# EAGLE design PCB_Draft_2 (EAGLE 9.6.2)
AUTHOR: R. Hall, A. Singh, K.Quizon; BOARD_NAME: ESP32 I2C Exp / M Driver; DOC_NUM: 0; PROJECT_NAME: R8-O7 PCB; REVISION: 4
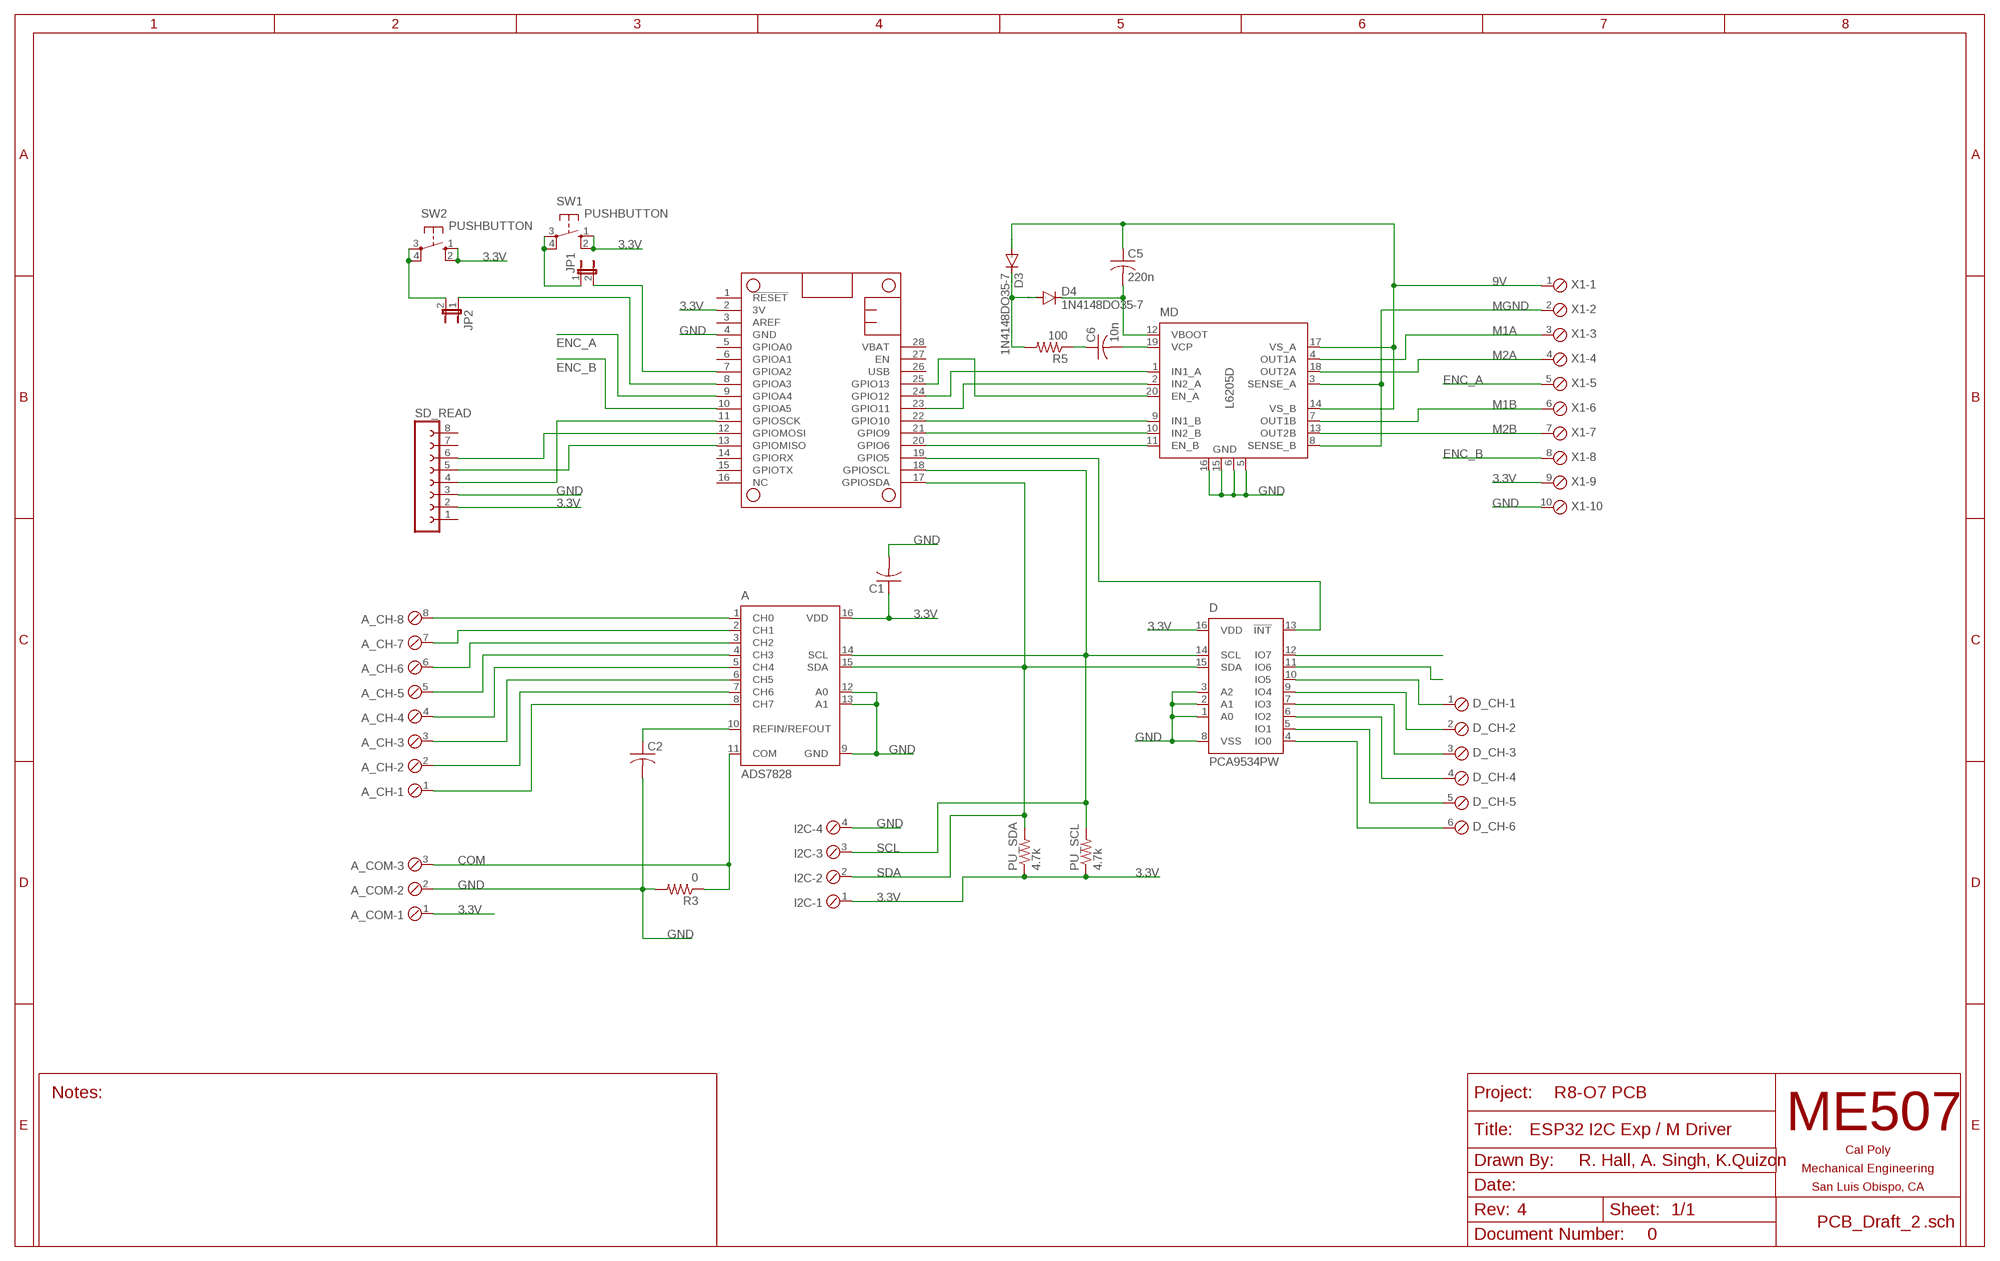
[diagram p0: schematic, sheet 1]

## Parts
A  ADS7828  [TSSOP16-PW]
A_CH  SCREWTERM_8P_254  [8POL254]
A_COM  SCREWTERM_3P_254  [3POL254]
C1  C-USC0805  [C0805]
C2  C-USC0805  [C0805]
C5  220n  C-USC0805  [C0805]
C6  10n  C-USC0805  [C0805]
D  PCA9534PW  [TSSOP16]
D3  1N4148DO35-7  [DO35-7]
D4  1N4148DO35-7  [DO35-7]
D_CH  SCREWTERM_6P_254  [6POL254]
FTHRWNG  FEATHERWINGEXTENDED_BOTH_ENDS  [FEATHERWING]
I2C  SCREWTERM_4P_254  [4POL254]
JP1  JP1E  [JP1]
JP2  JP1E  [JP1]
MD  L6205D  [SO20]
PU_SCL  4.7k  R-US_M0805  [M0805]
PU_SDA  4.7k  R-US_M0805  [M0805]
R3  0  R-US_M0805  [M0805]
R5  100  R-US_M0805  [M0805]
SD_READ  FE08-1  [FE08]
SW1  PUSHBUTTON  [B3F-10XX]
SW2  PUSHBUTTON  [B3F-10XX]
X1  SCREWTERM_10P_254  [10POL254]

## Nets
3.3V: A.16(VDD) A_COM.1 C1.1 D.16(VDD) FTHRWNG.2(3V) I2C.1 PU_SCL.1 PU_SDA.1 SD_READ.2 SW1.1(S) SW1.2(S1) SW2.1(S) SW2.2(S1) X1.9
9V: C5.1 D3.A MD.14(VS_B) MD.17(VS_A) X1.1
COM: A.11(COM) A_COM.3 R3.1
ENC_A: FTHRWNG.9(GPIOA4) X1.5
ENC_B: FTHRWNG.10(GPIOA5) X1.8
GND: A.9(GND) A.12(A0) A.13(A1) A_COM.2 C1.2 C2.2 D.1(A0) D.2(A1) D.3(A2) D.8(VSS) FTHRWNG.4(GND) I2C.4 MD.5(GND) MD.6(GND) MD.15(GND) MD.16(GND) R3.2 SD_READ.3 X1.10
M1A: MD.4(OUT1A) X1.3
M1B: MD.7(OUT1B) X1.6
M2A: MD.18(OUT2A) X1.4
M2B: MD.13(OUT2B) X1.7
MGND: MD.3(SENSE_A) MD.8(SENSE_B) X1.2
N$1: D.12(IO7)
N$2: D.11(IO6)
N$3: D.10(IO5) D_CH.1
N$4: D.9(IO4) D_CH.2
N$5: D.7(IO3) D_CH.3
N$6: D.6(IO2) D_CH.4
N$7: D.5(IO1) D_CH.5
N$8: D.4(IO0) D_CH.6
N$9: A.1(CH0) A_CH.8
N$10: A.2(CH1) A_CH.7
N$11: A.3(CH2) A_CH.6
N$12: A.4(CH3) A_CH.5
N$13: A.5(CH4) A_CH.4
N$14: A.6(CH5) A_CH.3
N$15: A.7(CH6) A_CH.2
N$16: A.8(CH7) A_CH.1
N$17: A.10(REFIN/REFOUT) C2.1
N$18: FTHRWNG.20(GPIO6) MD.11(EN_B)
N$19: D.13(!INT) FTHRWNG.19(GPIO5)
N$20: FTHRWNG.21(GPIO9) MD.10(IN2_B)
N$21: FTHRWNG.22(GPIO10) MD.9(IN1_B)
N$22: FTHRWNG.23(GPIO11) MD.2(IN2_A)
N$23: FTHRWNG.24(GPIO12) MD.1(IN1_A)
N$24: FTHRWNG.11(GPIOSCK) SD_READ.4
N$25: FTHRWNG.25(GPIO13) MD.20(EN_A)
N$26: JP1.1 SW1.3(P) SW1.4(P1)
N$27: JP2.2 SW2.3(P) SW2.4(P1)
N$28: FTHRWNG.13(GPIOMISO) SD_READ.5
N$29: FTHRWNG.8(GPIOA3) JP2.1
N$30: FTHRWNG.7(GPIOA2) JP1.2
N$31: FTHRWNG.12(GPIOMOSI) SD_READ.6
N$43: C6.2 MD.19(VCP)
N$44: C6.1 R5.1
N$45: D3.C D4.A R5.2
N$46: C5.2 D4.C MD.12(VBOOT)
SCL: A.14(SCL) D.14(SCL) FTHRWNG.18(GPIOSCL) I2C.3 PU_SCL.2
SDA: A.15(SDA) D.15(SDA) FTHRWNG.17(GPIOSDA) I2C.2 PU_SDA.2
Unconnected: FTHRWNG.1(!RESET) FTHRWNG.3(AREF) FTHRWNG.5(GPIOA0) FTHRWNG.6(GPIOA1) FTHRWNG.14(GPIORX) FTHRWNG.15(GPIOTX) FTHRWNG.16(NC) FTHRWNG.26(USB) FTHRWNG.27(EN) FTHRWNG.28(VBAT) SD_READ.1 SD_READ.7 SD_READ.8

## Library data of the parts
A = burr-brown:ADS7828: 12-Bit, 8-Channel Sampling ANALOG-TO-DIGITAL CONVERTER with I2C? Interface Source: www.ti.com .. ADS7828.pdf; MF: TEXAS INSTRUMENTS; MPN: ADS7828E/250; OC_FARNELL: 1470338; OC_NEWARK: 74C7158
A_CH = ME507:SCREWTERM_8P: Screw Terminal Block This part is designed for a screw terminal connector. The 2.54mm (0.100 inch) foorprint can also be used for male or female pin headers such as those on most development boards. One can also solder wires directly into the holes, though this makes modifications or repairs to the system more inconvenient. Larger versions can carry more current.
A_COM = ME507:SCREWTERM_3P: Screw Terminal Block This part is designed for a screw terminal connector. The 2.54mm (0.100 inch) foorprint can also be used for male or female pin headers such as those on most development boards. One can also solder wires directly into the holes, though this makes modifications or repairs to the system more inconvenient. Larger versions can carry more current.
C1 C2 C5 C6 = rcl:C-US: CAPACITOR, American symbol; SPICEPREFIX: C
D = micro-philips:PCA9534: 8-bit I2C-bus and SMBus low power I/O port with interrupt Source: www.nxp.com .. PCA9534_3.pdf; MPN: PCA9534PW; OC_FARNELL: 1408285; OC_NEWARK: 18M7516
D3 D4 = diode:1N4148: DIODE high speed (Philips)
D_CH = ME507:SCREWTERM_6P: Screw Terminal Block This part is designed for a screw terminal connector. The 2.54mm (0.100 inch) foorprint can also be used for male or female pin headers such as those on most development boards. One can also solder wires directly into the holes, though this makes modifications or repairs to the system more inconvenient. Larger versions can carry more current.
FTHRWNG = ME507:FEATHERWING: AdaFruitTM Feather Wing A modified version of a Featherwing, the add-on board for an AdaFruit(tm) Feather development board. There is a standard size version which is the same size as the Feather board on which the microcontroller hangs out. There is also an extended version, with each and longer by a quarter inch to allow for connectors such as screw terminals which aren't hidden under another board if this wing isn't on the top of the board stack. The pins are named in a generic fashion; these names do not necessarily correspond to Arduino or Python pin numbers. The designer must refer to the pinout diagram for each specific Feather board to find the functions of each pin.
I2C = ME507:SCREWTERM_4P: Screw Terminal Block This part is designed for a screw terminal connector. The 2.54mm (0.100 inch) foorprint can also be used for male or female pin headers such as those on most development boards. One can also solder wires directly into the holes, though this makes modifications or repairs to the system more inconvenient. Larger versions can carry more current.
JP1 JP2 = jumper:JP1E: JUMPER
MD = st-microelectronics:L6205: DUAL DMOS FULL BRIDGE MOTOR DRIVER; MPN: L6205D; OC_FARNELL: unknown; OC_NEWARK: 37M3487
PU_SCL PU_SDA R3 R5 = rcl:R-US_: RESISTOR, American symbol; SPICEPREFIX: R
SD_READ = con-lsta:FE08-1: FEMALE HEADER; OC_FARNELL: unknown; OC_NEWARK: unknown
SW1 SW2 = ME507:PUSHBUTTON: OMRON SWITCH; MPN: B3F-1000; OC_FARNELL: 176432; OC_NEWARK: 36M3542
X1 = ME507:SCREWTERM_10P: Screw Terminal Block This part is designed for a screw terminal connector. The 2.54mm (0.100 inch) foorprint can also be used for male or female pin headers such as those on most development boards. One can also solder wires directly into the holes, though this makes modifications or repairs to the system more inconvenient. Larger versions can carry more current.

## Board
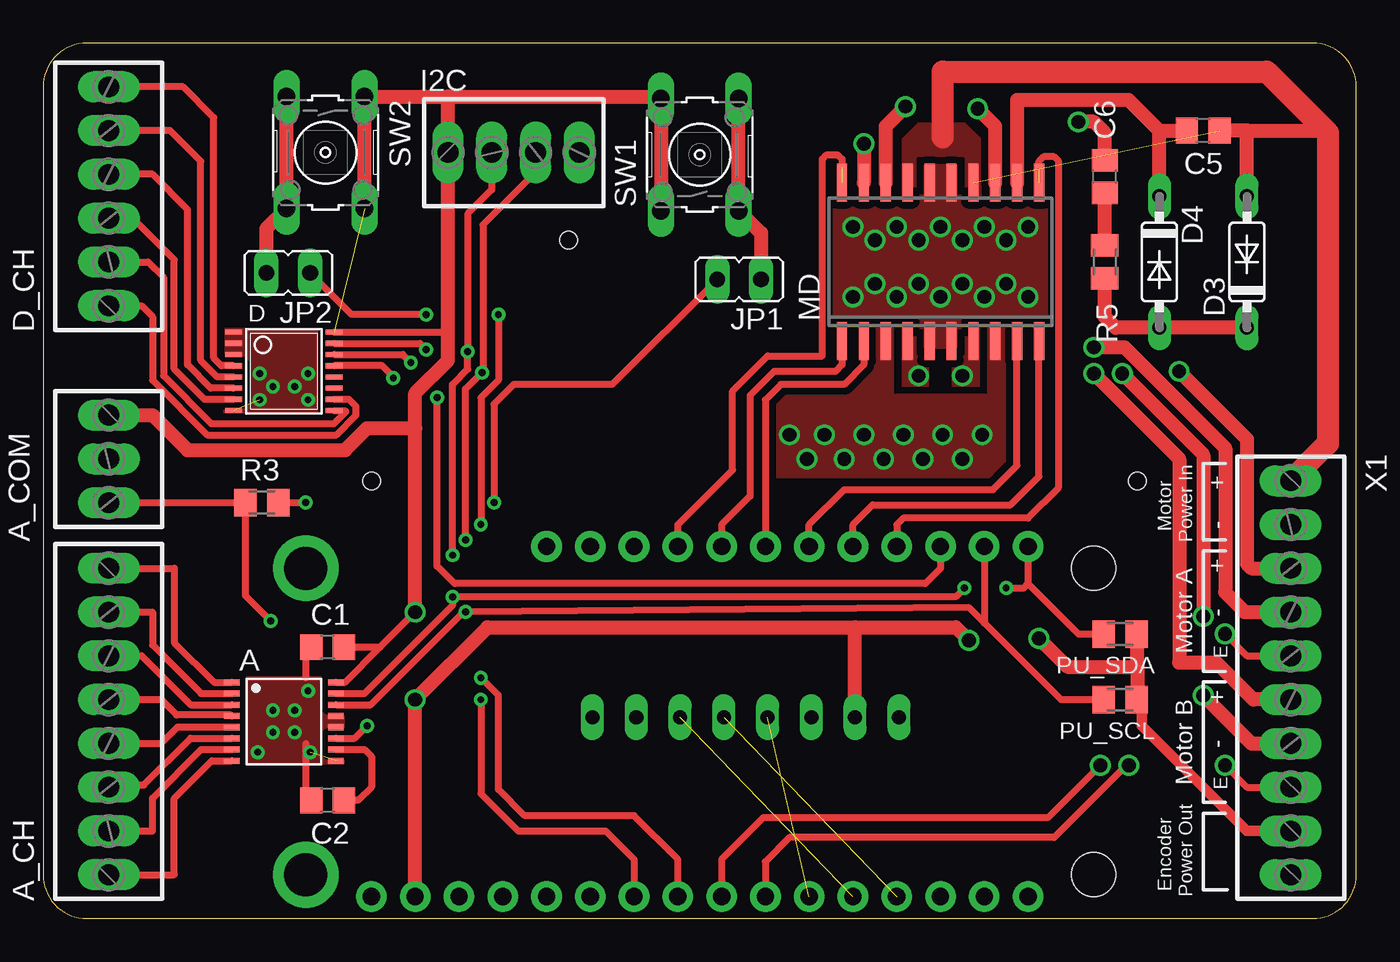
[diagram p1: board, top side]
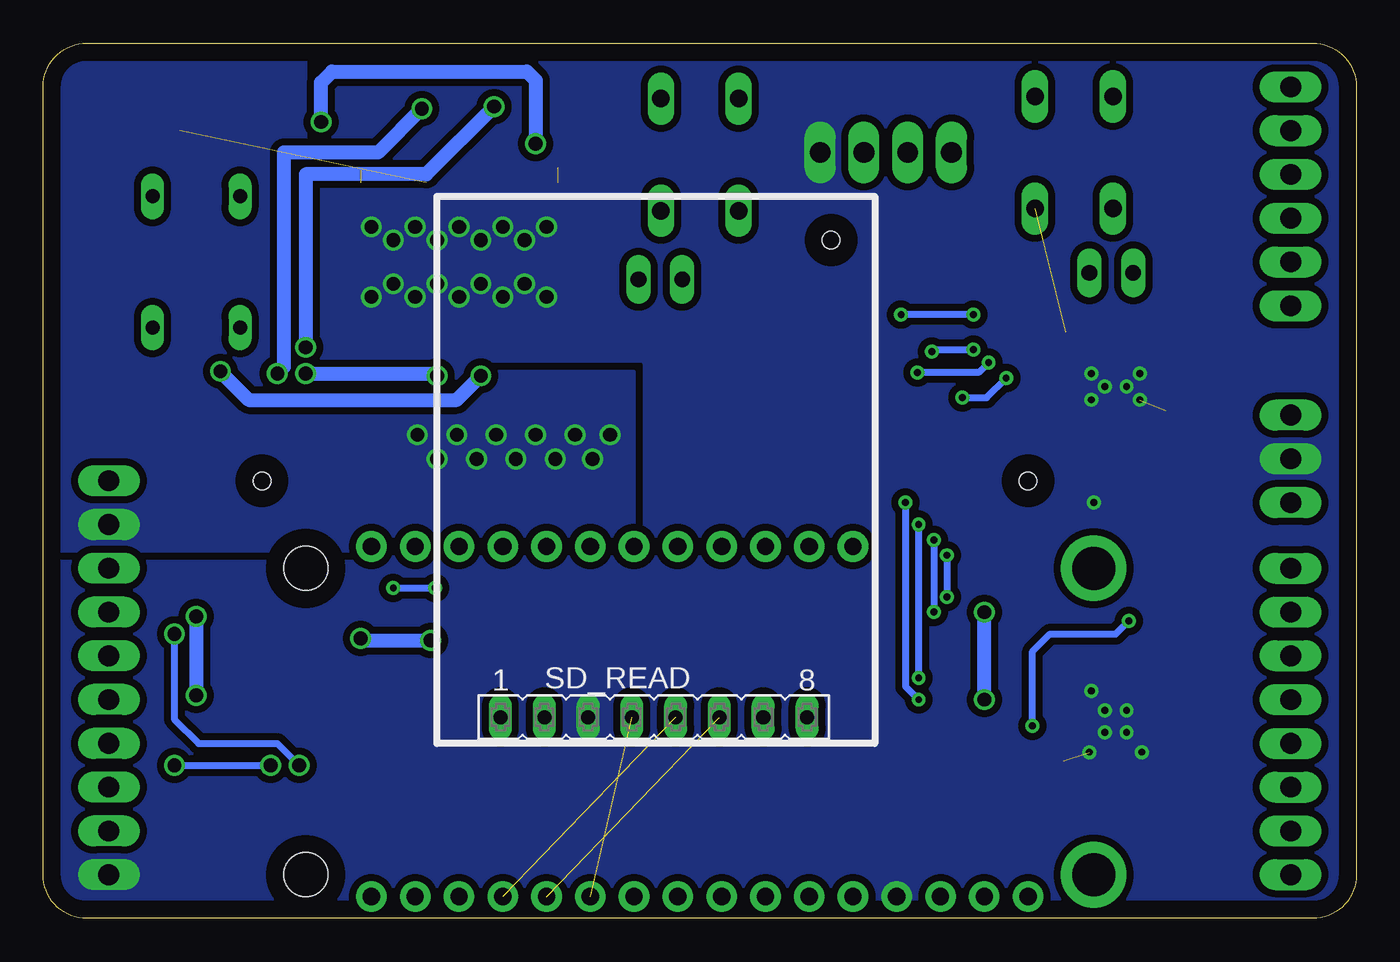
[diagram p2: board, bottom side, seen from below]

Size 76.2 x 50.8 mm. Coordinates in mm from the lower left corner, seen from the top.
Copper layers (1*16): Top 0.035mm / dielectric 1.5mm / Bottom 0.035mm
Design rules "default": minimum track width 6mil, minimum drill 0.35mm, track to track 6mil, track to pad 6mil, pad to pad 6mil, via to via 6mil, smd to smd 6mil, copper to edge 40mil, drill to drill 6mil, minimum pad ring 10mil, minimum via ring 8mil, stop-mask expansion 4mil, vias tented up to drill 0mil, thermal gap 10mil
Holes 1 mm at 30.48,39.37 19.05,25.4 63.5,25.4

### Footprints (pad centres in the part's own frame; a part is rotated, then mirrored left to right if it is on the bottom)
TSSOP16-PW = smd 0.35 x 0.9: 1 -2.275,-3.025; 2 -1.625,-3.025; 3 -0.975,-3.025; 4 -0.325,-3.025; 5 0.325,-3.025; 6 0.975,-3.025; 7 1.625,-3.025; 8 2.275,-3.025; 9 2.275,3.025; 10 1.625,3.025; 11 0.975,3.025; 12 0.325,3.025; 13 -0.325,3.025; 14 -0.975,3.025; 15 -1.625,3.025; 16 -2.275,3.025
8POL254 = drill 1.2 long: 1 -8.89,0; 2 -6.35,0; 3 -3.81,0; 4 -1.27,0; 5 1.27,0; 6 3.81,0; 7 6.35,0; 8 8.89,0
3POL254 = drill 1.2 long: 1 -2.54,0; 2 0,0; 3 2.54,0
C0805 = smd 1.3 x 1.5: 1 -0.95,0; 2 0.95,0
TSSOP16 = smd 0.305 x 0.991: 1 -2.275,-2.918; 2 -1.625,-2.918; 3 -0.975,-2.918; 4 -0.325,-2.918; 5 0.325,-2.918; 6 0.975,-2.918; 7 1.625,-2.918; 8 2.275,-2.918; 9 2.275,2.918; 10 1.625,2.918; 11 0.975,2.918; 12 0.325,2.918; 13 -0.325,2.918; 14 -0.975,2.918; 15 -1.625,2.918; 16 -2.275,2.918
DO35-7 = drill 0.813 long: A 3.81,0; C -3.81,0
6POL254 = drill 1.2 pad 1.778 long: 1 -6.35,0; 2 -3.81,0; 3 -1.27,0; 4 1.27,0; 5 3.81,0; 6 6.35,0
FEATHERWING = drill 1 pad 1.778: 1 6.35,1.27; 2 8.89,1.27; 3 11.43,1.27; 4 13.97,1.27; 5 16.51,1.27; 6 19.05,1.27; 7 21.59,1.27; 8 24.13,1.27; 9 26.67,1.27; 10 29.21,1.27; 11 31.75,1.27; 12 34.29,1.27; 13 36.83,1.27; 14 39.37,1.27; 15 41.91,1.27; 16 44.45,1.27; 17 44.45,21.59; 18 41.91,21.59; 19 39.37,21.59; 20 36.83,21.59; 21 34.29,21.59; 22 31.75,21.59; 23 29.21,21.59; 24 26.67,21.59; 25 24.13,21.59; 26 21.59,21.59; 27 19.05,21.59; 28 16.51,21.59 | drill 2.5 pad 3.81: P$1 2.54,20.32; P$2 2.54,2.54 | hole 2.54: 48.26,20.32; 48.26,2.54
4POL254 = drill 1.2 long: 1 -3.81,0; 2 -1.27,0; 3 1.27,0; 4 3.81,0
JP1 = drill 0.914 long: 1 0,-1.27; 2 0,1.27
SO20 = smd 0.6 x 2.2: 1 -5.715,-4.6; 2 -4.445,-4.6; 3 -3.175,-4.6; 4 -1.905,-4.6; 5 -0.635,-4.6; 6 0.635,-4.6; 7 1.905,-4.6; 8 3.175,-4.6; 9 4.445,-4.6; 10 5.715,-4.6; 11 5.715,4.6; 12 4.445,4.6; 13 3.175,4.6; 14 1.905,4.6; 15 0.635,4.6; 16 -0.635,4.6; 17 -1.905,4.6; 18 -3.175,4.6; 19 -4.445,4.6; 20 -5.715,4.6
M0805 = smd 1.3 x 1.6: 1 -0.95,0; 2 0.95,0
FE08 = drill 0.813 long: 1 -8.89,0; 2 -6.35,0; 3 -3.81,0; 4 -1.27,0; 5 1.27,0; 6 3.81,0; 7 6.35,0; 8 8.89,0
B3F-10XX = drill 1.016 long: 1 -3.251,2.261; 2 3.251,2.261; 3 -3.251,-2.261; 4 3.251,-2.261
10POL254 = drill 1.2 long: 1 -11.43,0; 2 -8.89,0; 3 -6.35,0; 4 -3.81,0; 5 -1.27,0; 6 1.27,0; 7 3.81,0; 8 6.35,0; 9 8.89,0; 10 11.43,0

### Placement (x,y rotation side)
A  13.97,11.43 270 top
A_CH  3.81,11.43 90 top
A_COM  3.81,26.67 270 top
C1  16.51,15.75 180 top
C2  16.51,6.86 180 top
C5  67.31,45.72 180 top
C6  61.59,43.05 90 top
D  13.97,31.75 270 top
D3  69.85,38.1 90 top
D4  64.77,38.1 270 top
D_CH  3.81,41.91 90 top
FTHRWNG  12.7,0 0 top
I2C  27.3,44.45 0 top
JP1  40.39,37.08 90 top
JP2  14.22,37.47 90 top
MD  52.07,38.1 0 top
PU_SCL  62.48,12.7 180 top
PU_SDA  62.48,16.51 180 top
R3  12.7,24.13 0 top
R5  61.59,38.1 270 top
SD_READ  40.77,11.68 0 bottom
SW1  38.1,44.32 90 top
SW2  16.38,44.45 270 top
X1  72.39,13.97 270 top

### Tracks (layer width: path | path; a pad name or v marks a point on that pad's centre or on a via)
3.3V  (via drill 0.8)  (1 unrouted)
  Top 0.406: A.16 17.52,13.71 19.56,15.75 | 19.56,15.75 v21.59,17.78 | C1.1 19.56,15.75 | D.16 23.36,34.02 23.5,34.16
  Top 0.61: X1.9 69.85,5.08 63.75,11.18 63.75,12.7 PU_SCL.1
  Top 0.813: SW2.2 SW2.1 23.5,47.7 | 23.5,47.7 35.71,47.7 SW1.2 SW1.1 | 23.5,47.7 I2C.1 23.5,32.38 21.59,30.48 21.59,28.45 | FTHRWNG.2 v21.59,12.7 25.78,16.89 47.12,16.89 | v53.72,16.13 52.96,16.89 47.12,16.89 | v21.59,17.78 21.59,28.45 | A_COM.1 6.35,29.21 8.38,27.18 17.53,27.18 18.8,28.45 21.59,28.45 | SD_READ.2 47.12,16.89 | 63.69,12.95 PU_SCL.1 63.5,12.77 63.5,14.61 | v57.78,16.26 59.44,14.61 63.5,14.61 | 63.5,14.61 63.5,16.44 PU_SDA.1
  Bottom 0.813: v21.59,12.7 v21.59,17.78 | v57.78,16.26 57.66,16.13 v53.72,16.13
9V  (1 unrouted)
  Top 0.813: D3.A 69.85,45.72 | 69.85,45.72 C5.1 | 69.85,45.72 74.42,45.72
  Top 1.27: 52.2,45.34 52.2,49.15 70.99,49.15 74.55,45.59 74.55,27.56 X1.1
  pour Top (isolate 0.406, rank 6, no thermals): 49.91,41.27 54.36,41.27 54.36,45.21 53.47,46.1 50.8,46.1 49.91,45.21
COM  (via drill 0.4)
  Top 0.406: A.11 18.07,10.46 v18.8,11.18 | v13.21,17.27 11.75,18.73 R3.1 A_COM.3
  Bottom 0.406: v18.8,11.18 18.8,15.49 17.78,16.51 13.97,16.51 v13.21,17.27
ENC_A  (via drill 0.8)
  Top 0.406: v68.58,16.51 69.85,15.24 X1.5 | v61.34,8.89 58.29,5.84 41.78,5.84 39.37,3.43 FTHRWNG.9
  Bottom 0.406: v68.58,16.51 68.58,11.56 67.18,10.16 62.61,10.16 v61.34,8.89
ENC_B  (via drill 0.8)
  Top 0.406: v68.58,8.89 69.85,7.62 X1.8 | v62.99,8.89 62.87,8.89 58.67,4.7 43.31,4.7 41.91,3.3 FTHRWNG.10
  Bottom 0.406: v68.58,8.89 v62.99,8.89
GND  (via drill 0.4, 0.8)  (2 unrouted)
  Top 0.406: C2.2 15.24,7.18 15.24,10.16 | C1.2 15.24,15.43 15.24,13.97 | R3.2 v15.24,24.13
  other vias: 46.99,40.13 48.26,39.37 49.53,40.13 50.8,39.37 52.07,40.13 53.34,39.37 54.61,40.13 55.88,39.37 57.15,40.13 57.15,36.07 55.88,36.83 54.61,36.07 53.34,36.83 52.07,36.07 50.8,36.83 49.53,36.07 48.26,36.83 46.99,36.07 15.37,31.62 14.61,30.86 15.37,30.1 13.34,30.86 12.57,30.1 12.57,31.62 15.37,13.21 13.34,12.06 12.45,9.65 15.49,9.65 13.34,10.79 14.61,10.79 14.61,12.06
  pour Bottom (isolate 0.406, rank 6, no thermals): 0,50.8 0,0 76.2,0 76.2,50.8
  pour Top (isolate 0.406, no thermals): 45.72,41.91 51.18,41.91 51.18,43.69 52.96,43.69 52.96,41.91 58.42,41.91 58.42,34.29 52.96,34.29 52.96,33.15 51.18,33.15 51.18,34.29 45.72,34.29
  pour Top (isolate 0.406, no thermals): 10.54,29.34 10.54,34.16 17.4,34.16 17.4,29.34
  pour Top (isolate 0.406, no thermals): 10.67,13.97 17.4,13.97 17.4,9.02 10.67,9.02
M1A  (via drill 0.8)
  Top 0.813: v65.91,31.75 69.85,27.81 69.85,20.57 70.1,20.32 X1.3
  Bottom 0.813: v50.8,31.5 52.2,30.1 64.26,30.1 v65.91,31.75
  pour Top (isolate 0.406, rank 6, no thermals): 49.91,34.54 49.91,30.73 51.31,30.73 51.31,34.54
M1B  (via drill 0.8)
  Top 0.813: X1.6 70.23,12.7 68.07,14.86 65.91,14.86 65.91,26.67 v60.96,31.62
  Bottom 0.813: v60.96,31.62 53.47,31.62 v53.34,31.5
  pour Top (isolate 0.406, rank 6, no thermals): 54.36,34.54 54.36,30.73 52.83,30.73 52.83,34.54
M2A  (via drill 0.8)
  Top 0.813: MD.18 48.9,45.97 v50.04,47.12 | v60.96,33.15 62.74,33.15 68.58,27.3 68.58,18.92 69.72,17.78 X1.4
  Bottom 0.813: v50.04,47.12 53.98,43.18 60.96,43.18 v60.96,33.15
M2B  (via drill 0.8)
  Top 0.813: MD.13 55.24,45.97 v54.23,46.99 | v62.61,31.62 67.31,26.92 v67.31,17.53 | v67.31,12.95 70.1,10.16 X1.7
  Bottom 0.813: v54.23,46.99 56.77,44.45 62.23,44.45 62.23,32 v62.61,31.62 | v67.31,17.53 v67.31,12.95
MGND  (via drill 0.8)
  other vias: 49.91,28.07 52.2,28.07 54.48,28.07 53.34,26.67 51.05,26.67 48.77,26.67 47.62,28.07 46.48,26.67 45.34,28.07 44.32,26.67 43.31,28.07
  pour Bottom (isolate 0.406, no thermals): 60.96,50.8 60.96,31.75 41.91,31.75 41.91,21.34 76.2,21.34 76.2,50.8
  pour Top (isolate 0.406, rank 4, no thermals): 48.13,34.67 49.28,34.67 49.28,30.35 54.86,30.35 54.86,34.54 56.13,34.54 56.13,26.42 55.37,25.65 41.91,25.65 41.91,31.75 48.13,31.75
N$3
  Top 0.406: D_CH.1 5.71,35.56 6.35,34.92 6.35,31.24 9.53,28.07 17.02,28.07 18.16,29.21 18.16,29.72 17.75,30.12 D.10
N$4
  Top 0.406: D_CH.2 6.1,38.1 6.99,37.21 6.99,31.5 9.78,28.7 16.86,28.7 17.57,29.41 17.52,29.48 D.9
N$5
  Top 0.406: D.7 9.37,30.12 7.62,31.88 7.62,38.23 5.21,40.64 D_CH.3
N$6
  Top 0.406: D.6 9.74,30.77 8.38,32.13 8.38,41.15 6.35,43.18 D_CH.4
N$7
  Top 0.406: D.5 10.1,31.43 9.14,32.38 9.14,43.94 7.37,45.72 D_CH.5
N$8
  Top 0.406: D.4 10.34,32.08 9.91,32.51 9.91,46.48 8.13,48.26 D_CH.6
N$9
  Top 0.406: A_CH.8 7.62,20.32 7.62,16 9.92,13.71 A.1
N$10
  Top 0.406: A_CH.7 6.35,17.78 6.35,15.88 9.17,13.05 A.2
N$11
  Top 0.406: A_CH.6 5.71,15.24 8.55,12.4 A.3
N$12
  Top 0.406: A_CH.5 6.86,12.7 7.75,11.81 10.89,11.81 A.4
N$13
  Top 0.406: A_CH.4 6.86,10.16 7.8,11.11 A.5
N$14
  Top 0.406: A_CH.3 3.94,7.75 5.84,7.75 8.55,10.46 A.6
N$15
  Top 0.406: A_CH.2 6.35,5.08 6.35,6.99 9.17,9.8 A.7
N$16
  Top 0.406: A_CH.1 7.62,2.54 7.62,6.99 9.79,9.15 A.8
N$17
  Top 0.406: A.10 18.64,9.8 19.05,9.4 19.05,7.62 18.29,6.86 C2.1
N$18  (1 unrouted)
  Top 0.406: 57.78,43.43 57.78,43.94 58.04,44.2 58.67,44.2 58.93,43.94 58.93,25.02 57.15,23.24 49.91,23.24 49.53,22.86 FTHRWNG.20
N$19  (via drill 0.4)
  Top 0.406: FTHRWNG.19 52.07,20.32 51.18,19.43 23.88,19.43 22.86,20.45 v22.86,30.23 | v20.32,31.37 20.32,31.44 19.68,32.08 D.13
  Bottom 0.406: v22.86,30.23 21.46,30.23 v20.32,31.37
N$20
  Top 0.406: FTHRWNG.21 46.99,22.86 48.13,24 56.13,24 57.78,25.65 MD.10
N$21
  Top 0.406: FTHRWNG.22 44.45,22.86 46.48,24.89 55.12,24.89 56.52,26.29 MD.9
N$22
  Top 0.406: MD.2 47.62,32.13 46.48,30.99 42.8,30.99 41.91,30.1 FTHRWNG.23
N$23
  Top 0.406: FTHRWNG.24 39.37,22.86 41.02,24.51 41.02,30.35 42.42,31.75 45.97,31.75 46.35,32.13 MD.1
N$24  (1 unrouted)
N$25  (1 unrouted)
  Top 0.406: 46.35,43.56 46.35,44.07 46.1,44.32 45.47,44.32 45.21,44.07 45.21,32.64 42.04,32.64 40.01,30.61 40.01,26.04 36.83,22.86 FTHRWNG.25
N$26
  Top 0.813: SW1.4 SW1.3 41.66,39.78 JP1.1
N$27
  Top 0.813: SW2.3 SW2.4 12.95,40.03 JP2.2
N$28  (1 unrouted)
N$29  (via drill 0.4)
  Top 0.406: v22.23,35.05 17.91,35.05 JP2.1 | v26.42,35.05 26.42,31.24 25.4,30.23 v25.4,22.86 | v25.4,13.97 26.42,12.95 26.42,7.49 27.94,5.97 34.29,5.97 36.83,3.43 FTHRWNG.8
  Bottom 0.406: v22.23,35.05 v26.42,35.05 | v25.4,22.86 v25.4,13.97
N$30  (via drill 0.4)
  Top 0.406: JP1.2 33.02,30.99 27.3,30.99 26.16,29.84 v26.16,24.13 | v25.4,12.7 25.4,7.24 27.56,5.08 32.64,5.08 34.29,3.43 FTHRWNG.7
  Bottom 0.406: v26.16,24.13 26.16,13.46 v25.4,12.7
N$31  (1 unrouted)
N$43  (via drill 0.8)
  Top 0.813: v47.62,44.96 MD.19 | C6.2 61.59,45.59 60.96,46.23 v60.07,46.23
  Bottom 0.813: v60.07,46.23 60.07,48.51 59.44,49.15 48.13,49.15 47.62,48.64 v47.62,44.96
N$44
  Top 0.813: R5.1 C6.1
N$45
  Top 0.813: D3.C D4.A 62.23,34.29 61.59,34.92 R5.2
N$46
  Top 0.813: D4.C 64.77,45.72 | 64.77,45.72 C5.2 | 64.77,45.72 62.99,47.5 56.52,47.5 MD.12
SCL  (via drill 0.4)
  Top 0.406: 54.61,17.14 59.05,12.7 PU_SCL.2 | FTHRWNG.18 54.61,17.14 | A.14 19.01,12.4 24.38,17.78 v24.51,17.78 53.71,18.04 54.61,17.14 | v24.51,21.97 24.51,30.73 v25.46,31.69 25.53,31.75 25.53,40.26 28.57,43.31 I2C.3 | D.14 20.87,32.73 v21.34,32.26
  Bottom 0.406: v24.51,21.97 v24.51,17.78 | v21.34,32.26 21.91,31.69 v25.46,31.69
SDA  (via drill 0.4)
  Top 0.406: FTHRWNG.17 57.15,19.43 | 57.15,19.43 60.07,16.51 PU_SDA.2 | A.15 18.64,13.05 23.75,18.16 v23.75,18.67 52.96,18.67 v53.47,19.18 | v23.75,21.08 23.75,30.99 24.64,31.88 v24.64,32.89 24.64,40.89 26.04,42.29 I2C.2 | D.15 21.87,33.38 v22.23,33.02 | v55.88,19.18 56.9,19.18 57.15,19.43
  Bottom 0.406: v55.88,19.18 v53.47,19.18 | v23.75,21.08 v23.75,18.67 | v24.64,32.89 24.51,33.02 v22.23,33.02

### Text on the board
tPlace: Motor / Power In | Motor A | Motor B
tNames: + | - | + | - | E | + | - | E | Encoder / Power Out